# Altium schematic sheet arty_BQ.SchDoc
size 431 x 279 mm; SheetNumber: 1; SheetTotal: 1
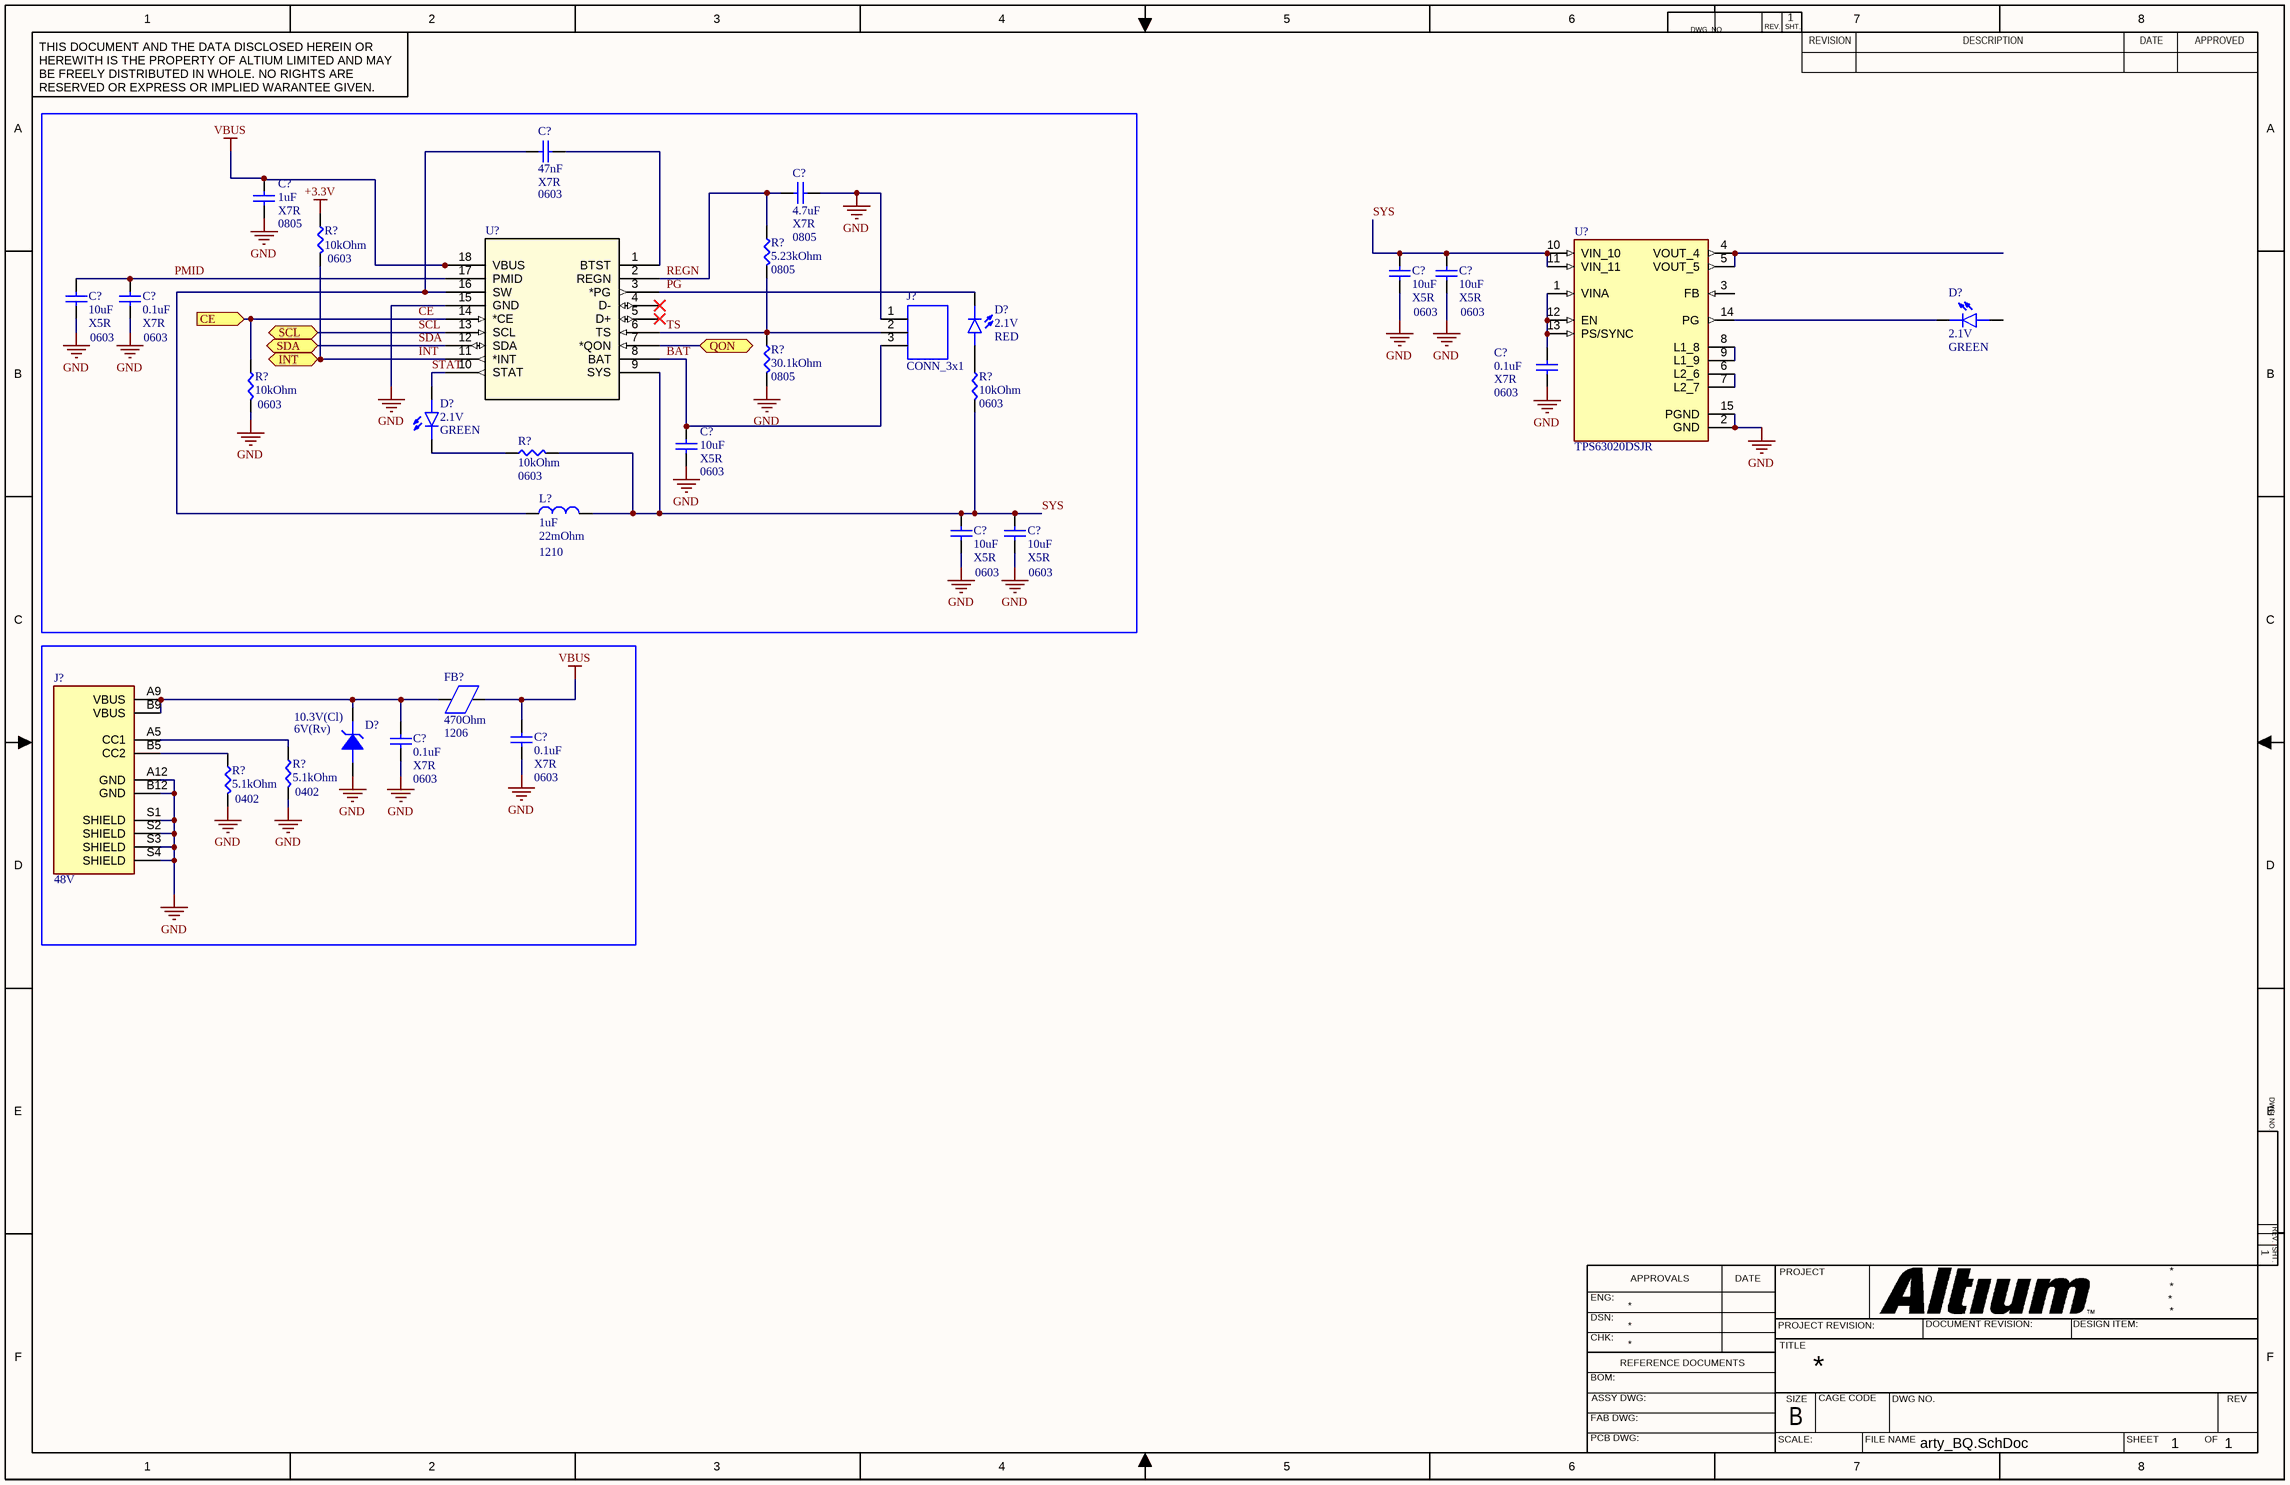
[diagram p0: arty_BQ.SchDoc]

## Parts
(Parts that share a designator on the sheet are numbered #1, #2 ... from top to bottom, then left to right.)
C?#1  <Value>: 47nF  <Spec>: X7R  <Footprint>: 0603  [CAPC1608X90N]  (hidden comment: CAP CER 0.047UF 50V X7R 0603)
C?#2  <Value>: 4.7uF  <Spec>: X7R  <Footprint>: 0805  [CAPC220145_145N_KEM]  (hidden comment: CAP CER 4.7UF 25V X7R 0805)
C?#3  <Value>: 1uF  <Spec>: X7R  <Footprint>: 0805  [CAPC2012X145N]  (hidden comment: CAP CER 1UF 50V X7R 0805)
C?#4  <Value>: 10uF  <Spec>: X5R  <Footprint>: 0603  [CAPC1608X120N]  (hidden comment: CAP CER 10UF 25V X5R 0603)
C?#5  <Value>: 10uF  <Spec>: X5R  <Footprint>: 0603  [CAPC1608X120N]  (hidden comment: CAP CER 10UF 25V X5R 0603)
C?#6  <Value>: 10uF  <Spec>: X5R  <Footprint>: 0603  [CAPC1608X120N]  (hidden comment: CAP CER 10UF 25V X5R 0603)
C?#7  <Value>: 0.1uF  <Spec>: X7R  <Footprint>: 0603  [CAPC1608X90N]  (hidden comment: CAP CER 0.1UF 50V X7R 0603)
C?#8  <Value>: 0.1uF  <Spec>: X7R  <Footprint>: 0603  [CAPC1608X90N]  (hidden comment: CAP CER 0.1UF 50V X7R 0603)
C?#9  <Value>: 10uF  <Spec>: X5R  <Footprint>: 0603  [CAPC1608X120N]  (hidden comment: CAP CER 10UF 25V X5R 0603)
C?#10  <Value>: 10uF  <Spec>: X5R  <Footprint>: 0603  [CAPC1608X120N]  (hidden comment: CAP CER 10UF 25V X5R 0603)
C?#11  <Value>: 10uF  <Spec>: X5R  <Footprint>: 0603  [CAPC1608X120N]  (hidden comment: CAP CER 10UF 25V X5R 0603)
C?#12  <Value>: 0.1uF  <Spec>: X7R  <Footprint>: 0603  [CAPC1608X90N]  (hidden comment: CAP CER 0.1UF 50V X7R 0603)
C?#13  <Value>: 0.1uF  <Spec>: X7R  <Footprint>: 0603  [CAPC1608X90N]  (hidden comment: CAP CER 0.1UF 50V X7R 0603)
D?#1  <Value>: 2.1V  <Spec>: RED  [LEDSC125X200X90-2N]  (hidden comment: LED RED 0805 SMD)
D?#2  <Value>: 2.1V  <Spec>: GREEN  [LEDM1608X80]  (hidden comment: LED GREEN CLEAR CHIP SMD)
D?#3  <Value>: 2.1V  <Spec>: GREEN  [LEDM1608X80]  (hidden comment: LED GREEN CLEAR CHIP SMD)
D?#4  <Value>: 10.3V(Cl)  <Spec>: 6V(Rv)  [WE-TVSP_DO-214AB_UNIDIRECTIONAL]  (hidden comment: TVS DIODE 6VWM 10.3VC DO214AB)
FB?  <Value>: 470Ohm  <Footprint>: 1206  [BEADC3216X180N]  (hidden comment: FERRITE BEAD 470 OHM 1206 1LN)
J?#1  CONN_3x1  [CONN_SD-43650-010_03_MOL]
J?#2  <Value>: 48V  [GCT_USB4515-GF-A_REVA]  (hidden comment: USB C REC 6P SMT MID MNT 1.6MM O)
L?  <Value>: 1uF  <Spec>: 22mOhm  <Footprint>: 1210  [SRP3212CL1R0M]  (hidden comment: FIXED IND 1UH 5A 22 MOHM SMD)
R?#1  <Value>: 10kOhm  <Footprint>: 0603  [RESC1608X55N]  (hidden comment: RES SMD 10K OHM 0.5% 1/10W 0603)
R?#2  <Value>: 5.23kOhm  <Footprint>: 0805  [RES_ERA6AEB3012V]  (hidden comment: RES SMD 5.23K OHM 0.1% 1/8W 0805)
R?#3  <Value>: 30.1kOhm  <Footprint>: 0805  [RES_ERA6AEB3012V]  (hidden comment: RES SMD 30.1K OHM 0.1% 1/8W 0805)
R?#4  <Value>: 10kOhm  <Footprint>: 0603  [RESC1608X55N]  (hidden comment: RES SMD 10K OHM 0.5% 1/10W 0603)
R?#5  <Value>: 10kOhm  <Footprint>: 0603  [RESC1608X55N]  (hidden comment: RES SMD 10K OHM 0.5% 1/10W 0603)
R?#6  <Value>: 10kOhm  <Footprint>: 0603  [RESC1608X55N]  (hidden comment: RES SMD 10K OHM 0.5% 1/10W 0603)
R?#7  <Value>: 5.1kOhm  <Footprint>: 0402  [RESC1005X35N]  (hidden comment: RES SMD 5.1K OHM 0.1% 1/16W 0402)
R?#8  <Value>: 5.1kOhm  <Footprint>: 0402  [RESC1005X35N]  (hidden comment: RES SMD 5.1K OHM 0.1% 1/16W 0402)
U?#1  IC CONTROLLED 1-CELL 3.5-A BUCK  [WQFN-HR18__RYK_TEX]  (value not drawn)
U?#2  TPS63020DSJR  [IC_TPS63020DSJR]

## Ports
CE (in), INT (bidir), QON (bidir), SCL (bidir), SDA (bidir)

## Nets
+3.3V: R?#1.2
GND: C?#2.1 C?#3.1 C?#4.1 C?#5.1 C?#6.1 C?#7.1 C?#8.2 C?#9.2 C?#10.1 C?#11.1 C?#12.1 C?#13.1 D?#4.A J?#1.1 J?#2.A12(GND) J?#2.B12(GND) J?#2.S1(SHIELD) J?#2.S2(SHIELD) J?#2.S3(SHIELD) J?#2.S4(SHIELD) R?#3.1 R?#4.1 R?#7.1 R?#8.1 U?#1.15(GND) U?#2.2(GND) U?#2.15(PGND)
VBUS: C?#3.2 C?#13.2 FB?.2 U?#1.18(VBUS)
BAT: C?#9.1 J?#1.3 U?#1.8(BAT)
CE: R?#4.2 U?#1.14(*CE) ; port CE
INT: R?#1.1 U?#1.11(*INT) ; port INT
PG: D?#1.C U?#1.3(*PG)
PMID: C?#6.2 C?#7.2 U?#1.17(PMID)
QON: U?#1.7(*QON) ; port QON
REGN: C?#2.2 R?#2.2 U?#1.2(REGN)
SCL: U?#1.13(SCL) ; port SCL
SDA: U?#1.12(SDA) ; port SDA
STAT: D?#3.A U?#1.10(STAT)
SYS: C?#4.2 C?#5.2 C?#10.2 C?#11.2 L?.2 R?#5.1 R?#6.1 U?#1.9(SYS) U?#2.10(VIN_10) U?#2.11(VIN_11)
TS: J?#1.2 R?#2.1 R?#3.2 U?#1.6(TS)
NetC?#1_1: C?#1.1 U?#1.1(BTST)
NetC?#1_2: C?#1.2 L?.1 U?#1.16(SW)
NetC?#8_1: C?#8.1 U?#2.1(VINA) U?#2.12(EN) U?#2.13(PS/SYNC)
NetC?#12_2: C?#12.2 D?#4.C FB?.1 J?#2.A9(VBUS) J?#2.B9(VBUS)
NetD?#1_A: D?#1.A R?#5.2
NetD?#2_C: D?#2.C U?#2.14(PG)
NetD?#3_C: D?#3.C R?#6.2
NetJ?#2_A5: J?#2.A5(CC1) R?#7.2
NetJ?#2_B5: J?#2.B5(CC2) R?#8.2
NetU?#2_4: U?#2.4(VOUT_4) U?#2.5(VOUT_5)
NetU?#2_6: U?#2.6(L2_6) U?#2.7(L2_7)
NetU?#2_8: U?#2.8(L1_8) U?#2.9(L1_9)

Not connected (* = marked no-connect by the designer): D?#2 A; U?#1 4(D-)* 5(D+)*; U?#2 3(FB)

## Notes on the sheet
- DWG. NO.
- REV.
- SHT.
- THIS DOCUMENT AND THE DATA DISCLOSED HEREIN OR HEREWITH IS THE PROPERTY OF ALTIUM LIMITED AND MAY BE FREELY DISTRIBUTED IN WHOLE. NO RIGHTS ARE RESERVED OR EXPRESS OR IMPLIED WARANTEE GIVEN.
- REVISION
- DESCRIPTION
- DATE
- APPROVED
- ENG:
- APPROVALS
- PROJECT
- DSN:
- CHK:
- REFERENCE DOCUMENTS
- PROJECT REVISION:
- TITLE
- DOCUMENT REVISION:
- DESIGN ITEM:
- BOM:
- FAB DWG:
- PCB DWG:
- ASSY DWG:
- SCALE:
- SIZE
- B
- CAGE CODE
- FILE NAME
- DWG NO.
- SHEET
- OF
- REV

## Library data of the parts
C?#1 = #1-017: Manufacturer (1): YAGEO; Manufacturer Part Num (1): CC0603JRX7R9BB473; AL-PN: #1-017; <Tolerance>: 0.05; SubType: Ceramic; <Termination>: SMD; Creator Project: aRTy; Type: Standard; Lead Time: 16 Weeks; PartType: Capacitor; <Rating>: 50V; Status: Verified; Digikey Label: 0.047 µF ±5% 50V Ceramic Capacitor X7R 0603 (1608 Metric); Digikey Part Num: 311-4019-2-ND
C?#2 = #1-018: Manufacturer (1): KEMET; Manufacturer Part Num (1): C0805C475J3RACTU; AL-PN: #1-018; <Tolerance>: 0.05; SubType: Ceramic; <Termination>: SMD; Creator Project: aRTy; Type: Standard; Lead Time: 64 Weeks; PartType: Capacitor; <Rating>: 25V; Status: Verified; Digikey Label: 4.7 µF ±5% 25V Ceramic Capacitor X7R 0805 (2012 Metric); Digikey Part Num: 399-C0805C475J3RACTUTR-ND
C?#3 = #1-019: Manufacturer (1): YAGEO; Manufacturer Part Num (1): CC0805JKX7R9BB105; AL-PN: #1-019; <Tolerance>: 0.05; SubType: Ceramic; <Termination>: SMD; Creator Project: aRTy; Type: Standard; Lead Time: 16 Weeks; PartType: Capacitor; <Rating>: 50V; Status: Verified; Digikey Label: 1 µF ±5% 50V Ceramic Capacitor X7R 0805 (2012 Metric); Digikey Part Num: 311-3498-2-ND
C?#4-C?#6 C?#9-C?#11 = #1-020: Manufacturer (1): Murata Electronics; Manufacturer Part Num (1): ZRB18AR61E106ME01L; AL-PN: #1-020; <Tolerance>: 0.2; SubType: Ceramic; <Termination>: SMD; Creator Project: aRTy; Type: Standard; Lead Time: 17 Weeks; PartType: Capacitor; <Rating>: 25V; Status: Verified; Digikey Label: 10 µF ±20% 25V Ceramic Capacitor X5R 0603 (1608 Metric); Digikey Part Num: 490-10991-2-ND
C?#7 C?#8 C?#12 C?#13 = #1-003: Manufacturer (1): Murata Electronics; Manufacturer Part Num (1): GCM188R71H104KA57J; AL-PN: #1-003; <Tolerance>: 0.1; SubType: Ceramic; <Termination>: SMD; Creator Project: Bootcamp; Type: Standard; Lead Time: 21 Weeks; PartType: Capacitor; <Rating>: 50V; Status: Verified; Digikey Label: 0.1 µF ±10% 50V Ceramic Capacitor X7R 0603 (1608 Metric); Digikey Part Num: 490-8020-2-ND
D?#1 = #1-014: Manufacturer (1): Dialight; Manufacturer Part Num (1): 5990110007F; AL-PN: #1-014; <Rating>: 30mA; Creator Project: Bootcamp; Type: Standard; Lead Time: 10 Weeks; PartType: Diode; SubType: LED; <Termination>: SMD; Status: Verified; Digikey Label: Red 633nm LED Indication - Discrete 2.1V 0805 (2012 Metric); Digikey Part Num: 350-4353-2-ND
D?#2 D?#3 = #1-009: Manufacturer (1): Lite-On Inc; Manufacturer Part Num (1): LTST-C190GKT; AL-PN: #1-009; <Footprint>: 0603; <Rating>: 30mA; Creator Project: Bootcamp; Type: Standard; Lead Time: 14 Weeks; PartType: Diode; SubType: LED; <Termination>: SMD; Status: Verified; Digikey Label: Green 569nm LED Indication - Discrete 2.1V 0603 (1608 Metric); Digikey Part Num: 160-LTST-C190GKTTR-ND
D?#4 = #1-027: Manufacturer (1): Würth Elektronik; Manufacturer Part Num (1): 824550600; AL-PN: #1-027; <Rating>: 7.02V(Bd); <Termination>: SMD; Creator Project: aRTy; Type: Standard; Lead Time: 24 Weeks; PartType: Diode; SubType: TVS; Status: Verified; Digikey Label: 10.3V Clamp 291.3A Ipp Tvs Diode Surface Mount DO-214AB; Digikey Part Num: 732-9905-2-ND
FB? = #1-026: Manufacturer (1): Murata Electronics; Manufacturer Part Num (1): BLM31KN471SZ1L; AL-PN: #1-026; <Rating>: 4A; <Termination>: SMD; Creator Project: aRTy; Type: Standard; Lead Time: 23 Weeks; PartType: Misc; SubType: Ferrite Bead; Status: Verified; Digikey Label: 470 Ohms @ 100 MHz 1 Power Line Ferrite Bead 1206 (3216 Metric) 4A 20mOhm; Digikey Part Num: 490-16531-2-ND
J?#1 = CONN_3x1: MF: {'manufacturer': u'Molex'}; MP: 436500329; Package: None; Price: None; Value: *; Availability: Unavailable
J?#2 = #1-010: Manufacturer (1): Global Connector Technology; Manufacturer Part Num (1): USB4515-GF-A; AL-PN: #1-010; <Rating>: 3A; <Termination>: SMD; Creator Project: Bootcamp; Lead Time: 7 Weeks; <Spec>: C; PartType: Connector; SubType: USB; Status: Verified; Digikey Label: USB-C (USB TYPE-C) Receptacle Connector 24 (6+18 Dummy) - Power Only 6 Pin Position Board Edge, Cutout; Surface Mount; Through Hole, Right Angle; Digikey Part Num: 2073-USB4515-GF-ATR-ND; Type: Standard
L? = #1-021: Manufacturer (1): Bourns Inc.; Manufacturer Part Num (1): SRP3212CL-1R0M; AL-PN: #1-021; <Tolerance>: 0.2; SubType: Shielded; Creator Project: aRTy; Type: Standard; Lead Time: 25 Weeks; PartType: Inductor; <Rating>: 5A; <Termination>: SMD; Status: Verified; Digikey Label: 1 µH Shielded Inductor 5 A 22mOhm Max 1210 (3225 Metric) Low DCR, Low Loss; Digikey Part Num: 118-SRP3212CL-1R0MTR-ND
R?#1 R?#4-R?#6 = #1-007: Manufacturer (1): YAGEO; Manufacturer Part Num (1): RT0603DRD0710KL; AL-PN: #1-007; <Tolerance>: 0.005; <Rating>: 0.1W; Creator Project: Bootcamp; Lead Time: 20 Weeks; PartType: Resistor; <Termination>: SMD; Status: Verified; Digikey Label: 10 kOhms ±0.5% 0.1W, 1/10W Chip Resistor 0603 (1608 Metric) Thin Film; Digikey Part Num: 311-10KDTR-ND; Type: Standard
R?#2 = #1-022: Manufacturer (1): Panasonic Industry; Manufacturer Part Num (1): ERA-6AEB5231V; AL-PN: #1-022; <Tolerance>: 0.001; <Rating>: 0.125W; Creator Project: aRTy; Lead Time: 41 Weeks; PartType: Resistor; <Termination>: SMD; Status: Verified; Digikey Label: 5.23 kOhms ±0.1% 0.125W, 1/8W Chip Resistor 0805 (2012 Metric) Automotive AEC-Q200 Thin Film; Digikey Part Num: 10-ERA-6AEB5231VTR-ND; Type: Standard
R?#3 = #1-023: Manufacturer (1): Panasonic Industry; Manufacturer Part Num (1): ERA-6AEB3012V; AL-PN: #1-023; <Tolerance>: 0.001; <Rating>: 0.125W; Creator Project: aRTy; Lead Time: 41 Weeks; PartType: Resistor; <Termination>: SMD; Status: Verified; Digikey Label: 30.1 kOhms ±0.1% 0.125W, 1/8W Chip Resistor 0805 (2012 Metric) Automotive AEC-Q200 Thin Film; Digikey Part Num: P30.1KDATR-ND; Type: Standard
R?#7 R?#8 = #1-024: Manufacturer (1): YAGEO; Manufacturer Part Num (1): RT0402BRE075K1L; AL-PN: #1-024; <Tolerance>: 0.001; Creator Project: aRTy; Lead Time: 20 Weeks; PartType: Resistor; <Rating>: 1/16W; <Termination>: SMD; Status: Verified; Digikey Label: 5.1 kOhms ±0.1% 0.063W, 1/16W Chip Resistor 0402 (1005 Metric) Thin Film; Digikey Part Num: YAG4404TR-ND; Type: Standard
U?#1 = #1-016: Manufacturer_Name: Texas Instruments; AL-PN: #1-016; <Value>: 1C; SubType: BMS; <Rating>: 3.5A; <Termination>: SMD; Creator Project: aRTy; Lead Time: 9 Weeks; Copyright: Copyright (C) 2025 Ultra Librarian. All rights reserved.; Manufacturer_Part_Number: BQ25620RYKR; RefDes: RefDes; Type: Standard; PartType: IC; Status: Verified; Digikey Label: Charger IC Lithium Ion/Polymer 18-WQFN-HR (3x2.5); Digikey Part Num: 296-BQ25620RYKRTR-ND; Manufacturer (1): Texas Instruments; Manufacturer Part Num (1): BQ25620RYKR
U?#2 = TPS63020DSJR: High Efficiency Single Inductor Buck-Boost Converter with 4A Switch; MF: Texas Instruments; SnapEDA_Link: https://www.snapeda.com/parts/TPS63020DSJR/Texas+Instruments/view-part/?ref=snap; Package: VSON-14 Texas Instruments; Value: *; MP: TPS63020DSJR; Check_prices: https://www.snapeda.com/parts/TPS63020DSJR/Texas+Instruments/view-part/?ref=eda